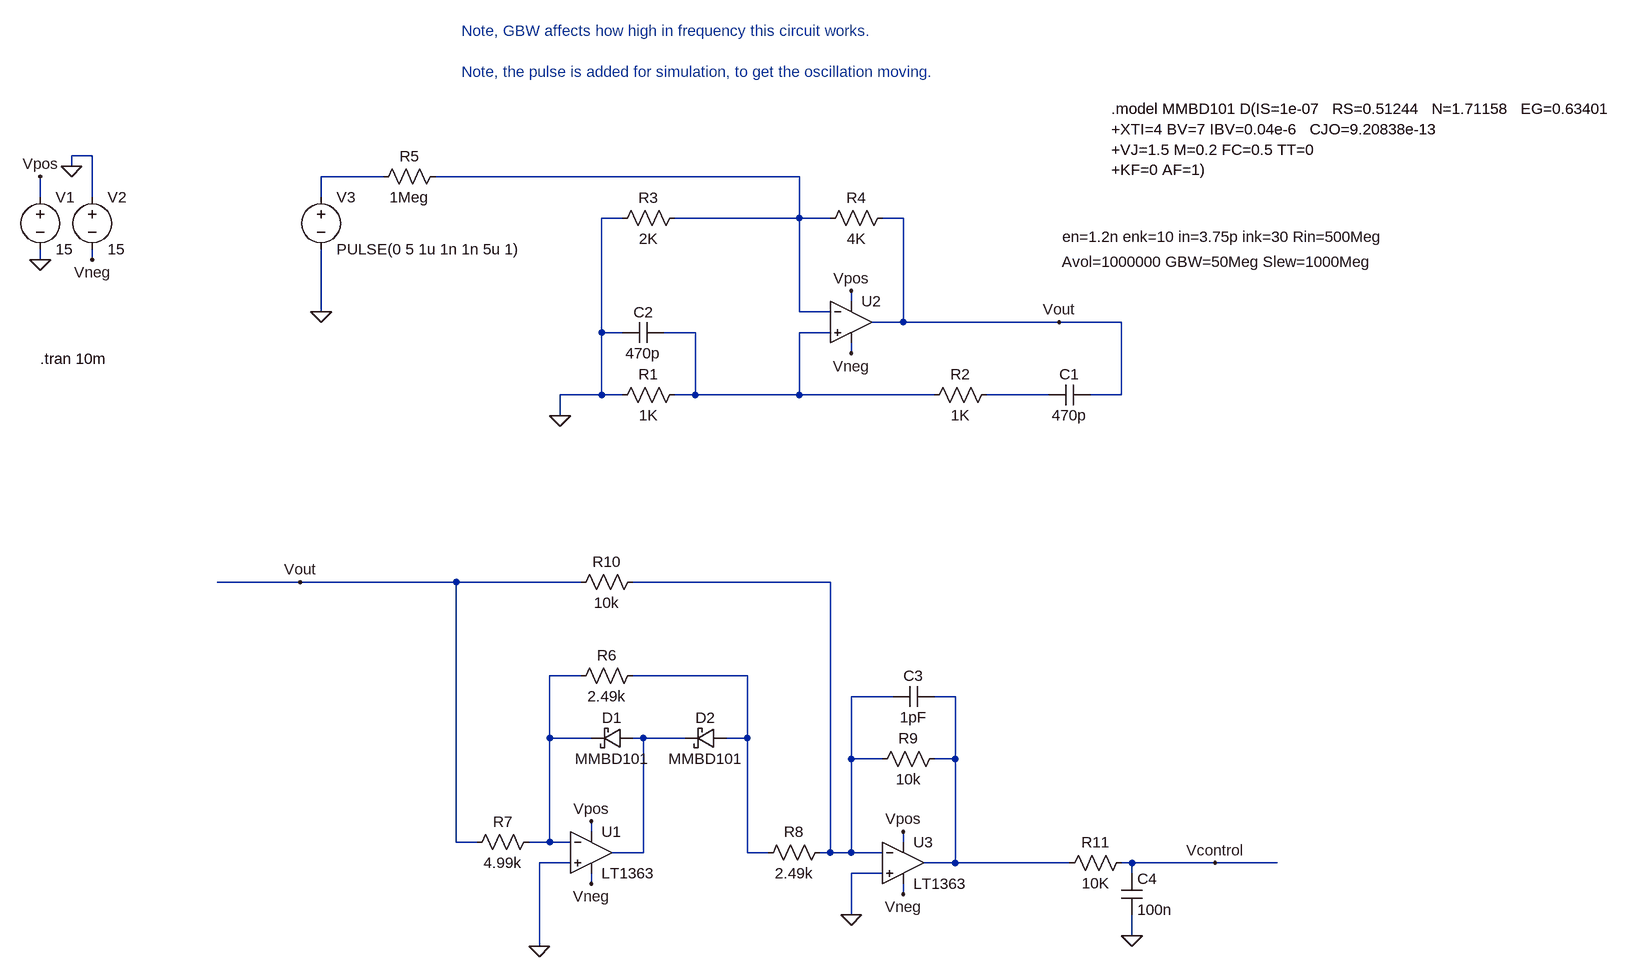
[diagram p0: schematic WienBridgeLT6275_with_AmplitudeControl.asc]
WienBridgeLT6275_with_AmplitudeControl.asc, the LTspice schematic file:
Version 4
SHEET 1 1452 1552
WIRE -992 304 -1024 304
WIRE -1024 320 -1024 304
WIRE -544 336 -640 336
WIRE 96 336 -464 336
WIRE -1072 368 -1072 336
WIRE -992 368 -992 304
WIRE -640 368 -640 336
WIRE -176 400 -208 400
WIRE 96 400 96 336
WIRE 96 400 -96 400
WIRE 144 400 96 400
WIRE 256 400 224 400
WIRE -1072 464 -1072 448
WIRE -992 464 -992 448
WIRE 176 528 176 512
WIRE -640 544 -640 448
WIRE 96 544 96 400
WIRE 144 544 96 544
WIRE 256 560 256 400
WIRE 256 560 208 560
WIRE 496 560 256 560
WIRE 592 560 496 560
WIRE -208 576 -208 400
WIRE -176 576 -208 576
WIRE -64 576 -112 576
WIRE 144 576 96 576
WIRE 176 608 176 592
WIRE -208 672 -208 576
WIRE -208 672 -272 672
WIRE -176 672 -208 672
WIRE -64 672 -64 576
WIRE -64 672 -96 672
WIRE 96 672 96 576
WIRE 96 672 -64 672
WIRE 304 672 96 672
WIRE 480 672 384 672
WIRE 592 672 592 560
WIRE 592 672 544 672
WIRE -272 704 -272 672
WIRE -672 960 -800 960
WIRE -432 960 -672 960
WIRE -240 960 -432 960
WIRE 144 960 -160 960
WIRE -240 1104 -288 1104
WIRE 16 1104 -160 1104
WIRE 240 1136 176 1136
WIRE 336 1136 304 1136
WIRE -288 1200 -288 1104
WIRE -224 1200 -288 1200
WIRE -144 1200 -160 1200
WIRE -80 1200 -144 1200
WIRE 16 1200 16 1104
WIRE 16 1200 -16 1200
WIRE 176 1232 176 1136
WIRE 224 1232 176 1232
WIRE 336 1232 336 1136
WIRE 336 1232 304 1232
WIRE -224 1344 -224 1328
WIRE -432 1360 -432 960
WIRE -400 1360 -432 1360
WIRE -288 1360 -288 1200
WIRE -288 1360 -320 1360
WIRE -256 1360 -288 1360
WIRE 256 1360 256 1344
WIRE -144 1376 -144 1200
WIRE -144 1376 -192 1376
WIRE 16 1376 16 1200
WIRE 48 1376 16 1376
WIRE 144 1376 144 960
WIRE 144 1376 128 1376
WIRE 176 1376 176 1232
WIRE 176 1376 144 1376
WIRE 224 1376 176 1376
WIRE -256 1392 -304 1392
WIRE 336 1392 336 1232
WIRE 336 1392 288 1392
WIRE 512 1392 336 1392
WIRE 608 1392 592 1392
WIRE 736 1392 608 1392
WIRE 832 1392 736 1392
WIRE 224 1408 176 1408
WIRE 608 1408 608 1392
WIRE -224 1424 -224 1408
WIRE 256 1440 256 1424
WIRE 176 1472 176 1408
WIRE 608 1504 608 1472
WIRE -304 1520 -304 1392
FLAG -1072 464 0
FLAG -1072 336 Vpos
FLAG -1024 320 0
FLAG -992 464 Vneg
FLAG 176 512 Vpos
FLAG 176 608 Vneg
FLAG -272 704 0
FLAG -640 544 0
FLAG -304 1520 0
FLAG 176 1472 0
FLAG 608 1504 0
FLAG -224 1328 Vpos
FLAG -224 1424 Vneg
FLAG 256 1344 Vpos
FLAG 256 1440 Vneg
FLAG 496 560 Vout
FLAG -672 960 Vout
FLAG 736 1392 Vcontrol
SYMBOL voltage -1072 352 R0
WINDOW 123 0 0 Left 2
WINDOW 39 0 0 Left 2
SYMATTR InstName V1
SYMATTR Value 15
SYMBOL voltage -992 352 R0
WINDOW 123 0 0 Left 2
WINDOW 39 0 0 Left 2
SYMATTR InstName V2
SYMATTR Value 15
SYMBOL res 128 416 R270
WINDOW 0 32 56 VTop 2
WINDOW 3 0 56 VBottom 2
SYMATTR InstName R4
SYMATTR Value 4K
SYMBOL cap 544 656 R90
WINDOW 0 0 32 VBottom 2
WINDOW 3 32 32 VTop 2
SYMATTR InstName C1
SYMATTR Value 470p
SYMATTR SpiceLine V=10 Irms=10.541 Rser=0.004 Lser=0
SYMBOL res -192 688 R270
WINDOW 0 32 56 VTop 2
WINDOW 3 0 56 VBottom 2
SYMATTR InstName R1
SYMATTR Value 1K
SYMBOL res 288 688 R270
WINDOW 0 32 56 VTop 2
WINDOW 3 0 56 VBottom 2
SYMATTR InstName R2
SYMATTR Value 1K
SYMBOL cap -112 560 R90
WINDOW 0 0 32 VBottom 2
WINDOW 3 32 32 VTop 2
SYMATTR InstName C2
SYMATTR Value 470p
SYMATTR SpiceLine V=10 Irms=10.541 Rser=0.004 Lser=0
SYMBOL res -192 416 R270
WINDOW 0 32 56 VTop 2
WINDOW 3 0 56 VBottom 2
SYMATTR InstName R3
SYMATTR Value 2K
SYMBOL voltage -640 352 R0
WINDOW 123 0 0 Left 2
WINDOW 39 0 0 Left 2
SYMATTR InstName V3
SYMATTR Value PULSE(0 5 1u 1n 1n 5u 1)
SYMBOL res -560 352 R270
WINDOW 0 32 56 VTop 2
WINDOW 3 0 56 VBottom 2
SYMATTR InstName R5
SYMATTR Value 1Meg
SYMBOL Opamps\\UniversalOpamp2 176 560 R0
WINDOW 123 324 -93 Left 2
WINDOW 40 325 -131 Left 2
SYMATTR Value2 Avol=1000000 GBW=50Meg Slew=1000Meg
SYMATTR SpiceLine2 en=1.2n enk=10 in=3.75p ink=30 Rin=500Meg
SYMATTR InstName U2
SYMBOL res -256 1120 R270
WINDOW 0 32 56 VTop 2
WINDOW 3 0 56 VBottom 2
SYMATTR InstName R6
SYMATTR Value 2.49k
SYMBOL res -416 1376 R270
WINDOW 0 32 56 VTop 2
WINDOW 3 0 56 VBottom 2
SYMATTR InstName R7
SYMATTR Value 4.99k
SYMBOL res 144 1360 R90
WINDOW 0 0 56 VBottom 2
WINDOW 3 32 56 VTop 2
SYMATTR InstName R8
SYMATTR Value 2.49k
SYMBOL res 208 1248 R270
WINDOW 0 32 56 VTop 2
WINDOW 3 0 56 VBottom 2
SYMATTR InstName R9
SYMATTR Value 10k
SYMBOL res -256 976 R270
WINDOW 0 32 56 VTop 2
WINDOW 3 0 56 VBottom 2
SYMATTR InstName R10
SYMATTR Value 10k
SYMBOL cap 304 1120 R90
WINDOW 0 0 32 VBottom 2
WINDOW 3 32 32 VTop 2
SYMATTR InstName C3
SYMATTR Value 1pF
SYMATTR SpiceLine V=10 Irms=10.541 Rser=0.004 Lser=0 mfg="KEMET" pn="C0603C105K8PAC" type="X5R"
SYMBOL cap 592 1408 R0
SYMATTR InstName C4
SYMATTR Value 100n
SYMATTR SpiceLine V=10 Irms=0 Rser=0.002 Lser=0
SYMBOL res 496 1408 R270
WINDOW 0 32 56 VTop 2
WINDOW 3 0 56 VBottom 2
SYMATTR InstName R11
SYMATTR Value 10K
SYMATTR SpiceLine tol=1 pwr=0.1
SYMBOL Opamps\\LT1363 -224 1312 R0
SYMATTR InstName U1
SYMBOL Opamps\\LT1363 256 1328 R0
SYMATTR InstName U3
SYMBOL schottky -160 1184 R90
WINDOW 0 0 32 VBottom 2
WINDOW 3 32 32 VTop 2
SYMATTR InstName D1
SYMATTR Value MMBD101
SYMATTR Description Diode
SYMATTR Type diode
SYMBOL schottky -16 1184 R90
WINDOW 0 0 32 VBottom 2
WINDOW 3 32 32 VTop 2
SYMATTR InstName D2
SYMATTR Value MMBD101
SYMATTR Description Diode
SYMATTR Type diode
TEXT -1072 616 Left 2 !.tran 10m
TEXT -424 112 Left 2 ;Note, GBW affects how high in frequency this circuit works.\n \nNote, the pulse is added for simulation, to get the oscillation moving.
TEXT 576 232 Left 2 !.model MMBD101 D(IS=1e-07   RS=0.51244   N=1.71158   EG=0.63401\n+XTI=4 BV=7 IBV=0.04e-6   CJO=9.20838e-13\n+VJ=1.5 M=0.2 FC=0.5 TT=0\n+KF=0 AF=1)

The netlist it stands for:
* WienBridgeLT6275_with_AmplitudeControl.asc
V1 Vpos 0 15
V2 0 Vneg 15
R4 N002 Vout 4K
C1 Vout N004 470p V=10 Irms=10.541 Rser=0.004 Lser=0
R1 0 N003 1K
R2 N003 N004 1K
C2 N003 0 470p V=10 Irms=10.541 Rser=0.004 Lser=0
R3 0 N002 2K
V3 N001 0 PULSE(0 5 1u 1n 1n 5u 1)
R5 N001 N002 1Meg
XU2 N003 N002 Vpos Vneg Vout level.2 Avol=1000000 GBW=50Meg Slew=1000Meg ilimit=25m rail=0 Vos=0 phimargin=45 en=1.2n enk=10 in=3.75p ink=30 Rin=500Meg  ; pins IN+ IN- V+ V- OUT
R6 N006 N007 2.49k
R7 Vout N006 4.99k
R8 N005 N007 2.49k
R9 N005 N008 10k
R10 Vout N005 10k
C3 N008 N005 1pF V=10 Irms=10.541 Rser=0.004 Lser=0 mfg="KEMET" pn="C0603C105K8PAC" type="X5R"
C4 Vcontrol 0 100n V=10 Irms=0 Rser=0.002 Lser=0
R11 N008 Vcontrol 10K tol=1 pwr=0.1
XU1 0 N006 Vpos Vneg N009 LT1363  ; pins In+ In- V+ V- OUT
XU3 0 N005 Vpos Vneg N008 LT1363  ; pins In+ In- V+ V- OUT
D1 N009 N006 MMBD101
D2 N007 N009 MMBD101
.model D D
.lib standard.dio
.tran 10m
* Note, GBW affects how high in frequency this circuit works.
* Note, the pulse is added for simulation, to get the oscillation moving.
.model MMBD101 D(IS=1e-07   RS=0.51244   N=1.71158   EG=0.63401
+XTI=4 BV=7 IBV=0.04e-6   CJO=9.20838e-13
+VJ=1.5 M=0.2 FC=0.5 TT=0
+KF=0 AF=1)
.lib UniversalOpamps2.sub
.lib LT1363.sub
.backanno
.end